# EAGLE design Busboard v12 (EAGLE 8.5.2)
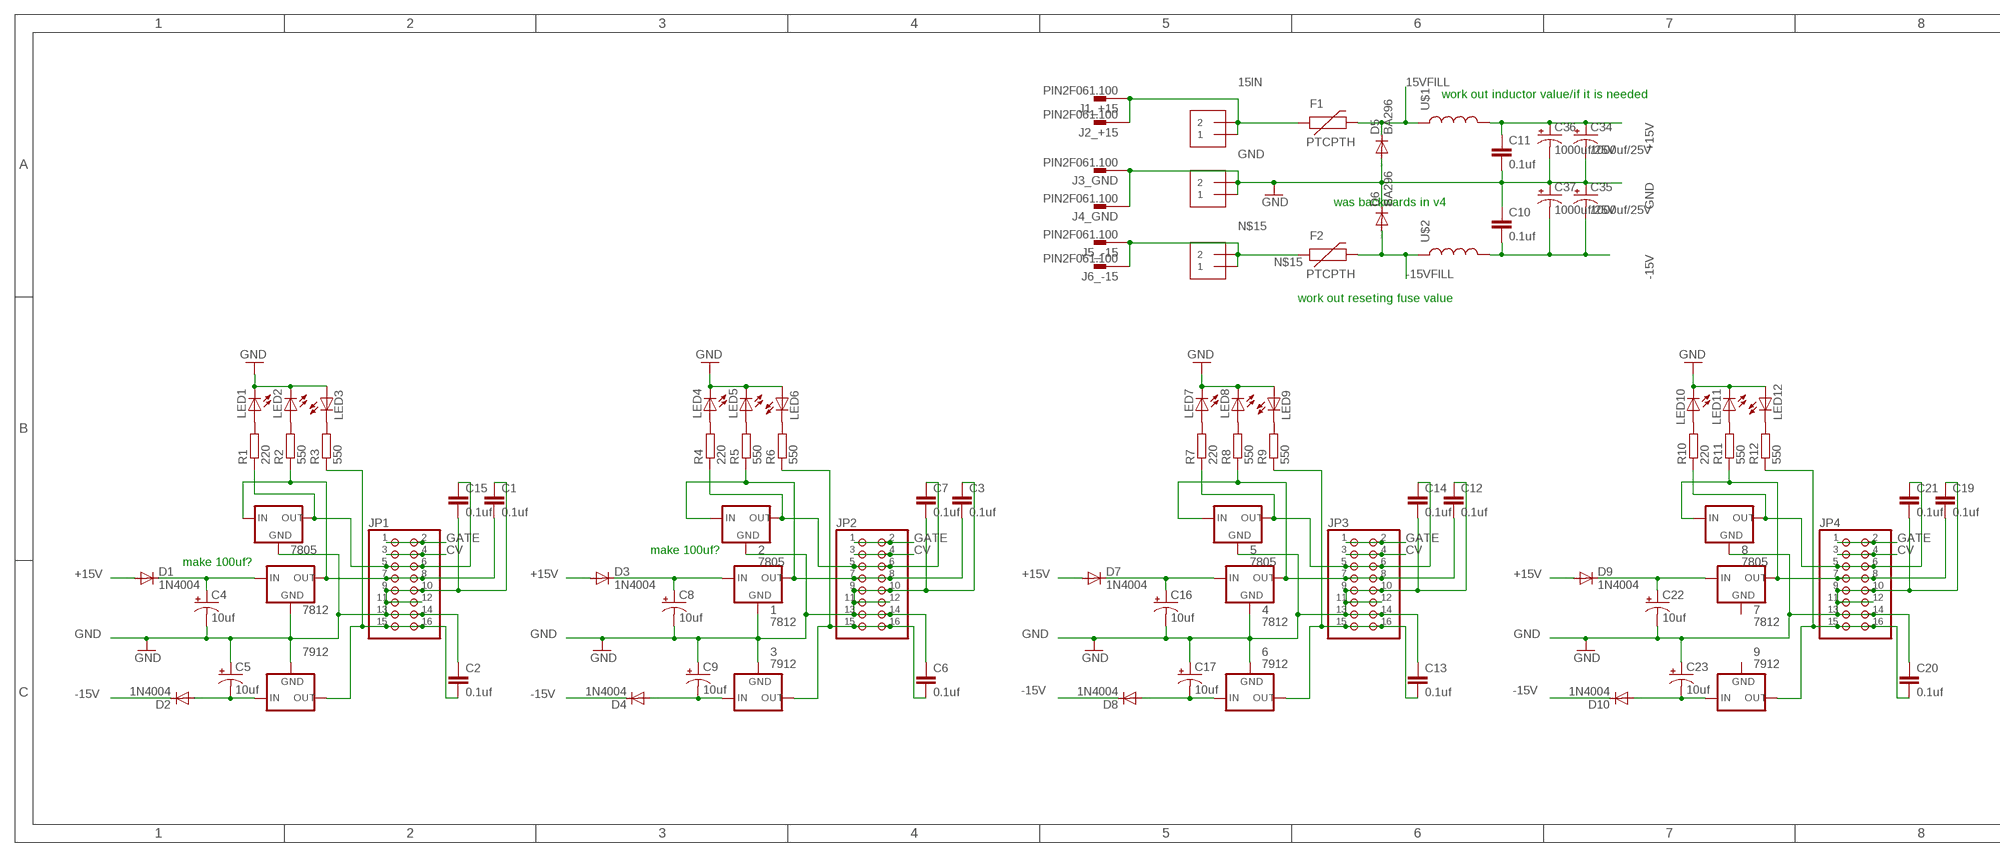
[diagram p0: schematic, sheet 1, part 1 of 2]
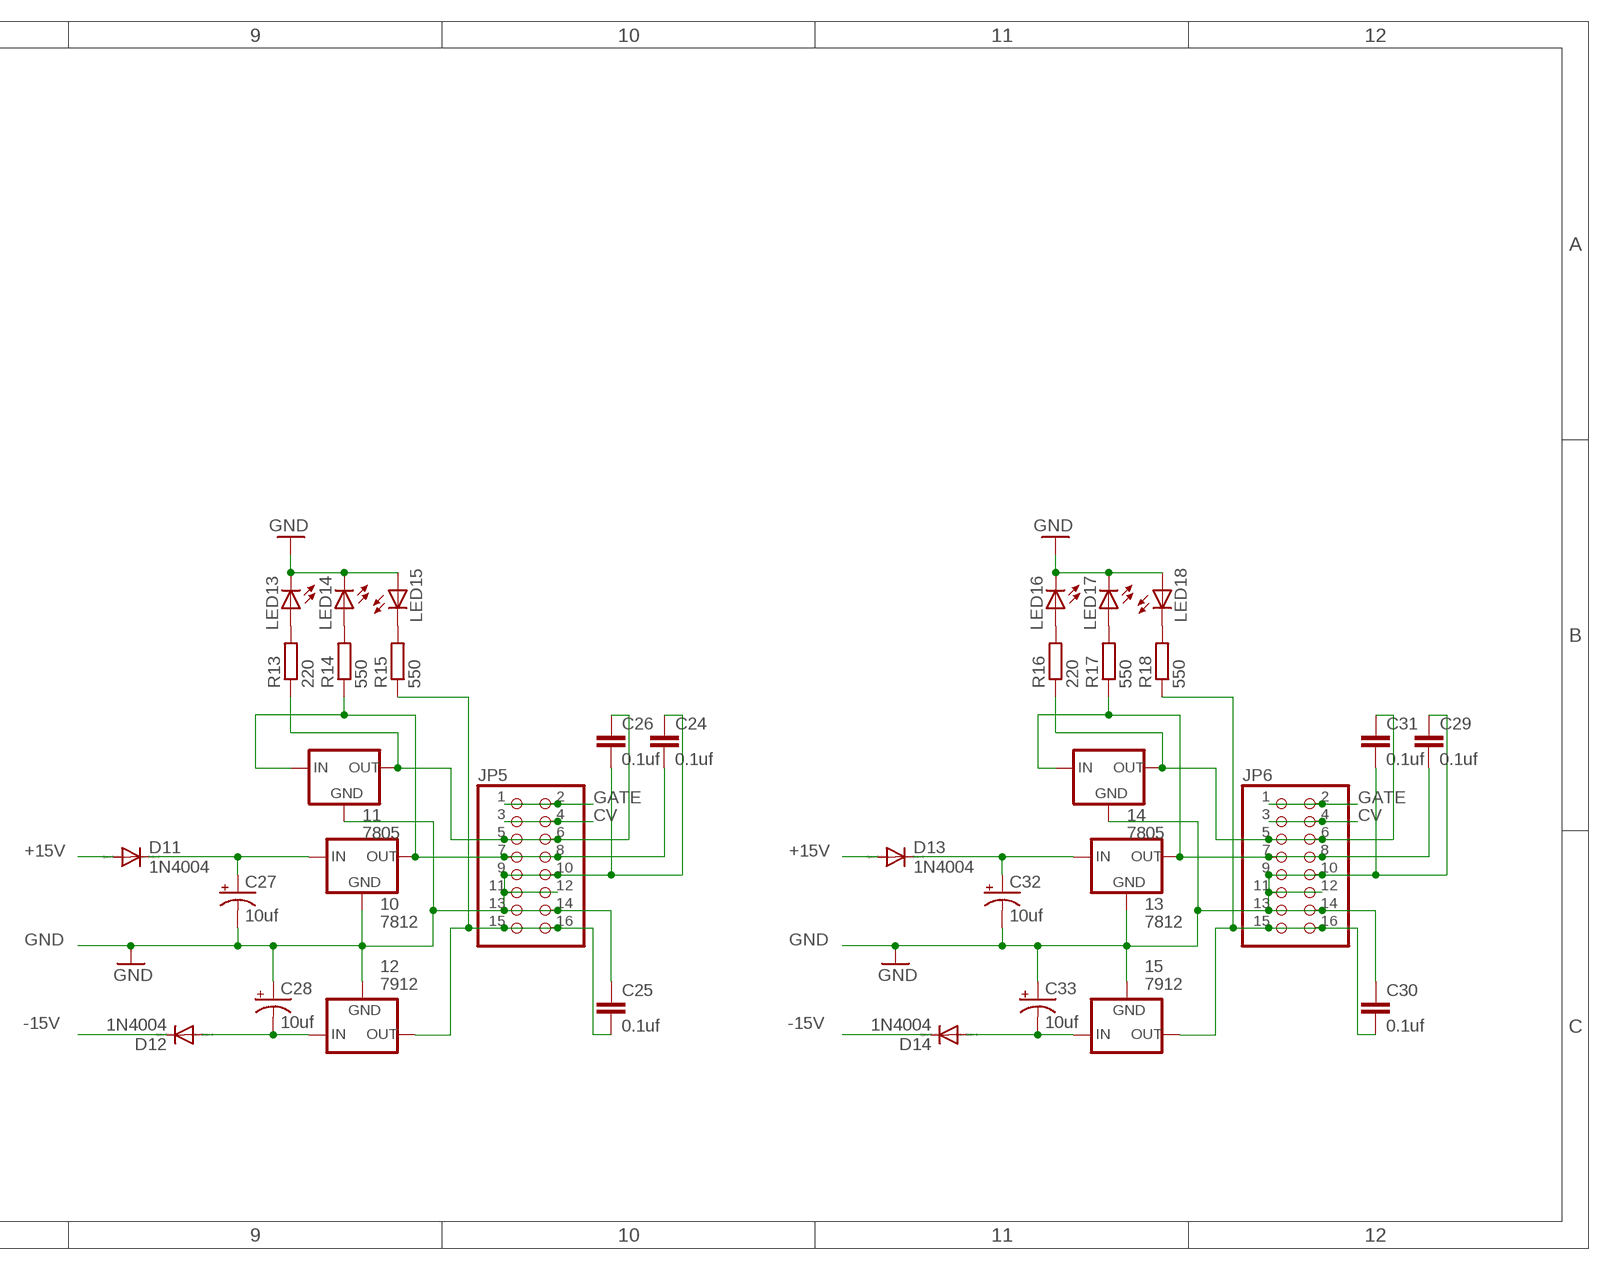
[diagram p1: schematic, sheet 1, part 2 of 2]

## Parts
1  7812  78MXXS  [78MXXS]
2  7805  78MXXS  [78MXXS]
3  7912  79XXS  [79XXS]
4  7812  78MXXS  [78MXXS]
5  7805  78MXXS  [78MXXS]
6  7912  79XXS  [79XXS]
7  7812  78MXXS  [78MXXS]
8  7805  78MXXS  [78MXXS]
9  7912  79XXS  [79XXS]
10  7812  78MXXS  [78MXXS]
11  7805  78MXXS  [78MXXS]
12  7912  79XXS  [79XXS]
13  7812  78MXXS  [78MXXS]
14  7805  78MXXS  [78MXXS]
15  7912  79XXS  [79XXS]
7805  78MXXS  [78MXXS]
7812  78MXXS  [78MXXS]
7912  79XXS  [79XXS]
+15V  1X2-3.5MM  [1X2-3.5MM]
-15V  1X2-3.5MM  [1X2-3.5MM]
C1  0.1uf  0.1UF-50V-20%(PTH)KIT-EZ  [CAP-PTH-SMALL-KIT]
C2  0.1uf  0.1UF-50V-20%(PTH)KIT-EZ  [CAP-PTH-SMALL-KIT]
C3  0.1uf  0.1UF-50V-20%(PTH)KIT-EZ  [CAP-PTH-SMALL-KIT]
C4  10uf  10UF-25V-20%(PTH)  [CPOL-RADIAL-10UF-25V]
C5  10uf  10UF-25V-20%(PTH)  [CPOL-RADIAL-10UF-25V]
C6  0.1uf  0.1UF-50V-20%(PTH)KIT-EZ  [CAP-PTH-SMALL-KIT]
C7  0.1uf  0.1UF-50V-20%(PTH)KIT-EZ  [CAP-PTH-SMALL-KIT]
C8  10uf  10UF-25V-20%(PTH)  [CPOL-RADIAL-10UF-25V]
C9  10uf  10UF-25V-20%(PTH)  [CPOL-RADIAL-10UF-25V]
C10  0.1uf  0.1UF-50V-20%(PTH)KIT-EZ  [CAP-PTH-SMALL-KIT]
C11  0.1uf  0.1UF-50V-20%(PTH)KIT-EZ  [CAP-PTH-SMALL-KIT]
C12  0.1uf  0.1UF-50V-20%(PTH)KIT-EZ  [CAP-PTH-SMALL-KIT]
C13  0.1uf  0.1UF-50V-20%(PTH)KIT-EZ  [CAP-PTH-SMALL-KIT]
C14  0.1uf  0.1UF-50V-20%(PTH)KIT-EZ  [CAP-PTH-SMALL-KIT]
C15  0.1uf  0.1UF-50V-20%(PTH)KIT-EZ  [CAP-PTH-SMALL-KIT]
C16  10uf  10UF-25V-20%(PTH)  [CPOL-RADIAL-10UF-25V]
C17  10uf  10UF-25V-20%(PTH)  [CPOL-RADIAL-10UF-25V]
C19  0.1uf  0.1UF-50V-20%(PTH)KIT-EZ  [CAP-PTH-SMALL-KIT]
C20  0.1uf  0.1UF-50V-20%(PTH)KIT-EZ  [CAP-PTH-SMALL-KIT]
C21  0.1uf  0.1UF-50V-20%(PTH)KIT-EZ  [CAP-PTH-SMALL-KIT]
C22  10uf  10UF-25V-20%(PTH)  [CPOL-RADIAL-10UF-25V]
C23  10uf  10UF-25V-20%(PTH)  [CPOL-RADIAL-10UF-25V]
C24  0.1uf  0.1UF-50V-20%(PTH)KIT-EZ  [CAP-PTH-SMALL-KIT]
C25  0.1uf  0.1UF-50V-20%(PTH)KIT-EZ  [CAP-PTH-SMALL-KIT]
C26  0.1uf  0.1UF-50V-20%(PTH)KIT-EZ  [CAP-PTH-SMALL-KIT]
C27  10uf  10UF-25V-20%(PTH)  [CPOL-RADIAL-10UF-25V]
C28  10uf  10UF-25V-20%(PTH)  [CPOL-RADIAL-10UF-25V]
C29  0.1uf  0.1UF-50V-20%(PTH)KIT-EZ  [CAP-PTH-SMALL-KIT]
C30  0.1uf  0.1UF-50V-20%(PTH)KIT-EZ  [CAP-PTH-SMALL-KIT]
C31  0.1uf  0.1UF-50V-20%(PTH)KIT-EZ  [CAP-PTH-SMALL-KIT]
C32  10uf  10UF-25V-20%(PTH)  [CPOL-RADIAL-10UF-25V]
C33  10uf  10UF-25V-20%(PTH)  [CPOL-RADIAL-10UF-25V]
C34  1000uf/25V  1000UF-25V(PTH)KIT  [CPOL-RADIAL-1000UF-25V-KIT]
C35  1000uf/25V  1000UF-25V(PTH)KIT  [CPOL-RADIAL-1000UF-25V-KIT]
C36  1000uf/25V  1000UF-25V(PTH)KIT  [CPOL-RADIAL-1000UF-25V-KIT]
C37  1000uf/25V  1000UF-25V(PTH)KIT  [CPOL-RADIAL-1000UF-25V-KIT]
D1  1N4004  [DO41-10]
D2  1N4004  [DO41-10]
D3  1N4004  [DO41-10]
D4  1N4004  [DO41-10]
D5  BA296  [P2-15]
D6  BA296  [P2-15]
D7  1N4004  [DO41-10]
D8  1N4004  [DO41-10]
D9  1N4004  [DO41-10]
D10  1N4004  [DO41-10]
D11  1N4004  [DO41-10]
D12  1N4004  [DO41-10]
D13  1N4004  [DO41-10]
D14  1N4004  [DO41-10]
F1  PTCPTH  [PTC]
F2  PTCPTH  [PTC]
GND  1X2-3.5MM  [1X2-3.5MM]
J1_+15  PIN2F061.100  [F061.100]
J2_+15  PIN2F061.100  [F061.100]
J3_GND  PIN2F061.100  [F061.100]
J4_GND  PIN2F061.100  [F061.100]
J5_-15  PIN2F061.100  [F061.100]
J6_-15  PIN2F061.100  [F061.100]
JP1  PINHD-2X8  [2X08]
JP2  PINHD-2X8  [2X08]
JP3  PINHD-2X8  [2X08]
JP4  PINHD-2X8  [2X08]
JP5  PINHD-2X8  [2X08]
JP6  PINHD-2X8  [2X08]
LED1  LED3MM  [LED3MM]
LED2  LED3MM  [LED3MM]
LED3  LED3MM  [LED3MM]
LED4  LED3MM  [LED3MM]
LED5  LED3MM  [LED3MM]
LED6  LED3MM  [LED3MM]
LED7  LED3MM  [LED3MM]
LED8  LED3MM  [LED3MM]
LED9  LED3MM  [LED3MM]
LED10  LED3MM  [LED3MM]
LED11  LED3MM  [LED3MM]
LED12  LED3MM  [LED3MM]
LED13  LED3MM  [LED3MM]
LED14  LED3MM  [LED3MM]
LED15  LED3MM  [LED3MM]
LED16  LED3MM  [LED3MM]
LED17  LED3MM  [LED3MM]
LED18  LED3MM  [LED3MM]
R1  220  R-EU_0207/5V  [0207/5V]
R2  550  R-EU_0207/5V  [0207/5V]
R3  550  R-EU_0207/5V  [0207/5V]
R4  220  R-EU_0207/5V  [0207/5V]
R5  550  R-EU_0207/5V  [0207/5V]
R6  550  R-EU_0207/5V  [0207/5V]
R7  220  R-EU_0207/5V  [0207/5V]
R8  550  R-EU_0207/5V  [0207/5V]
R9  550  R-EU_0207/5V  [0207/5V]
R10  220  R-EU_0207/5V  [0207/5V]
R11  550  R-EU_0207/5V  [0207/5V]
R12  550  R-EU_0207/5V  [0207/5V]
R13  220  R-EU_0207/5V  [0207/5V]
R14  550  R-EU_0207/5V  [0207/5V]
R15  550  R-EU_0207/5V  [0207/5V]
R16  220  R-EU_0207/5V  [0207/5V]
R17  550  R-EU_0207/5V  [0207/5V]
R18  550  R-EU_0207/5V  [0207/5V]
U$1  INDUCTORRLB0912  [RLB0912]
U$2  INDUCTORRLB0912  [RLB0912]

## Nets
15IN: +15V.1 +15V.2 F1.P$1 J1_+15.A1 J1_+15.A2 J2_+15.A1 J2_+15.A2
15VFILL: D5.C F1.P$2 U$1.1
+15V: C11.1 C34.+ C36.+ D1.A D3.A D7.A D9.A D11.A D13.A U$1.2
-15V: C10.2 C35.- C37.- D2.C D4.C D8.C D10.C D12.C D14.C U$2.2
-15VFILL: D6.A F2.P$2 U$2.1
CV: JP1.3 JP1.4 JP2.3 JP2.4 JP3.3 JP3.4 JP4.3 JP4.4 JP5.3 JP5.4 JP6.3 JP6.4
GATE: JP1.1 JP1.2 JP2.1 JP2.2 JP3.1 JP3.2 JP4.1 JP4.2 JP5.1 JP5.2 JP6.1 JP6.2
GND: 1.GND 2.GND 3.GND 4.GND 5.GND 6.GND 8.GND 10.GND 11.GND 12.GND 13.GND 14.GND 15.GND 7805.GND 7812.GND 7912.GND C1.1 C2.1 C3.1 C4.2(-) C5.1(+) C6.1 C7.2 C8.2(-) C9.1(+) C10.1 C11.2 C12.1 C13.1 C14.2 C15.2 C16.2(-) C17.1(+) C19.1 C20.1 C21.2 C22.2(-) C23.1(+) C24.1 C25.1 C26.2 C27.2(-) C28.1(+) C29.1 C30.1 C31.2 C32.2(-) C33.1(+) C34.- C35.+ C36.- C37.+ D5.A D6.C GND.1 GND.2 J3_GND.A1 J3_GND.A2 J4_GND.A1 J4_GND.A2 JP1.9 JP1.10 JP1.11 JP1.12 JP1.13 JP1.14 JP2.9 JP2.10 JP2.11 JP2.12 JP2.13 JP2.14 JP3.9 JP3.10 JP3.11 JP3.12 JP3.13 JP3.14 JP4.9 JP4.10 JP4.11 JP4.12 JP4.13 JP4.14 JP5.9 JP5.10 JP5.11 JP5.12 JP5.13 JP5.14 JP6.9 JP6.10 JP6.11 JP6.12 JP6.13 JP6.14 LED1.K(C) LED2.K(C) LED3.A LED4.K(C) LED5.K(C) LED6.A LED7.K(C) LED8.K(C) LED9.A LED10.K(C) LED11.K(C) LED12.A LED13.K(C) LED14.K(C) LED15.A LED16.K(C) LED17.K(C) LED18.A
N$1: 7912.IN C5.2(-) D2.A
N$2: 7912.OUT C2.2 JP1.15 JP1.16 R3.1
N$3: 6.OUT C13.2 JP3.15 JP3.16 R9.1
N$4: 7812.IN C4.1(+) D1.C
N$5: 7805.IN 7812.OUT C1.2 JP1.7 JP1.8 R2.1
N$6: 3.OUT C6.2 JP2.15 JP2.16 R6.1
N$7: 6.IN C17.2(-) D8.A
N$8: 3.IN C9.2(-) D4.A
N$9: 1.IN C8.1(+) D3.C
N$12: LED1.A R1.2
N$14: LED2.A R2.2
N$15: -15V.1 -15V.2 F2.P$1 J5_-15.A1 J5_-15.A2 J6_-15.A1 J6_-15.A2
N$17: LED3.K(C) R3.2
N$18: 1.OUT 2.IN C3.2 JP2.7 JP2.8 R5.1
N$19: 4.IN C16.1(+) D7.C
N$20: 2.OUT C7.1 JP2.5 JP2.6 R4.1
N$21: 7805.OUT C15.1 JP1.5 JP1.6 R1.1
N$23: LED4.A R4.2
N$24: LED5.A R5.2
N$25: LED6.K(C) R6.2
N$26: 4.OUT 5.IN C12.2 JP3.7 JP3.8 R8.1
N$27: 5.OUT C14.1 JP3.5 JP3.6 R7.1
N$28: LED7.A R7.2
N$29: LED8.A R8.2
N$30: LED9.K(C) R9.2
N$47: 9.OUT C20.2 JP4.15 JP4.16 R12.1
N$48: 9.IN C23.2(-) D10.A
N$49: 7.IN C22.1(+) D9.C
N$50: 7.OUT 8.IN C19.2 JP4.7 JP4.8 R11.1
N$51: 8.OUT C21.1 JP4.5 JP4.6 R10.1
N$52: LED10.A R10.2
N$53: LED11.A R11.2
N$54: LED12.K(C) R12.2
N$55: 15.OUT C30.2 JP6.15 JP6.16 R18.1
N$56: 12.OUT C25.2 JP5.15 JP5.16 R15.1
N$57: 12.IN C28.2(-) D12.A
N$58: 10.IN C27.1(+) D11.C
N$59: 10.OUT 11.IN C24.2 JP5.7 JP5.8 R14.1
N$60: 11.OUT C26.1 JP5.5 JP5.6 R13.1
N$61: LED13.A R13.2
N$62: LED14.A R14.2
N$63: LED15.K(C) R15.2
N$64: 15.IN C33.2(-) D14.A
N$65: 13.IN C32.1(+) D13.C
N$66: 13.OUT 14.IN C29.2 JP6.7 JP6.8 R17.1
N$67: 14.OUT C31.1 JP6.5 JP6.6 R16.1
N$68: LED16.A R16.2
N$69: LED17.A R17.2
N$70: LED18.K(C) R18.2
Unconnected: 7.GND 9.GND

## Notes on the sheet
- work out inductor value/if it is needed
- was backwards in v4
- work out reseting fuse value
- make 100uf?
- make 100uf?

## Library data of the parts
1 2 4 5 7 8 10 11 13 14 7805 7812 = v-reg:78MXXS: VOLTAGE REGULATOR
3 6 9 12 15 7912 = v-reg:79XXS: VOLTAGE REGULATOR
+15V -15V GND = adafruit:1X2: 3.5mm Terminal block http://www.ladyada.net/library/pcb/eaglelibrary.html
C1-C3 C6 C7 C10-C15 C19-C21 C24-C26 C29-C31 = SparkFun-Capacitors:0.1UF-50V-20%(PTH): CAP-08370; PROD_ID: CAP-08370
C4 C5 C8 C9 C16 C17 C22 C23 C27 C28 C32 C33 = SparkFun-Capacitors:10UF-25V-20%(PTH): CAP-08440; PROD_ID: CAP-08440
C34-C37 = SparkFun-Capacitors:1000UF-25V(PTH): CAP-08070; PROD_ID: CAP-09538
D1-D4 D7-D14 = diode:1N4004: DIODE general purpose rectifier, 1 A
D5 D6 = diode:BA296: DIODE
F1 F2 = SparkFun-PowerIC:PTC: Resettable Fuse PTC Resettable Fuse. Spark Fun Electronics SKU : COM-08357
J1_+15 J2_+15 J3_GND J4_GND J5_-15 J6_-15 = con-faston:PIN2: Flachstecker Typ Tyco/Electronics/AMP TAB, FASTON Printed Circuit Board Tabs Source: http://www.buerklin.com, http://catalog.tycoelectronics.com; OC_FARNELL: unknown; OC_NEWARK: unknown
JP1-JP6 = pinhead:PINHD-2X8: PIN HEADER
LED1-LED18 = led:LED: LED OSRAM: - CHIPLED LG R971, LG N971, LY N971, LG Q971, LY Q971, LO R971, LY R971 LH N974, LH R974 LS Q976, LO Q976, LY Q976 LO Q996 - Hyper CHIPLED LW Q18S LB Q993, LB Q99A, LB R99A - SideLED LS A670, LO A670, LY A670, LG A670, LP A670 LB A673, LV A673, LT A673, LW A673 LH A674 LY A675 LS A676, LA A676, LO A676, LY A676, LW A676 LS A679, LY A679, LG A679 - Hyper Micro SIDELED® LS Y876, LA Y876, LO Y876, LY Y876 LT Y87S - SmartLED LW L88C, LW L88S LB L89C, LB L89S, LG L890 LS L89K, LO L89K, LY L89K LS L896, LA L896, LO L896, LY L896 - TOPLED LS T670, LO T670, LY T670, LG T670, LP T670 LSG T670, LSP T670, LSY T670, LOP T670, LYG T670 LG T671, LOG T671, LSG T671 LB T673, LV T673, LT T673, LW T673 LH T674 LS T676, LA T676, LO T676, LY T676, LB T676, LH T676, LSB T676, LW T676 LB T67C, LV T67C, LT T67C, LS T67K, LO T67K, LY T67K, LW E67C LS E67B, LA E67B, LO E67B, LY E67B, LB E67C, LV E67C, LT E67C LW T67C LS T679, LY T679, LG T679 LS T770, LO T770, LY T770, LG T770, LP T770 LB T773, LV T773, LT T773, LW T773 LH T774 LS E675, LA E675, LY E675, LS T675 LS T776, LA T776, LO T776, LY T776, LB T776 LHGB T686 LT T68C, LB T68C - Hyper Mini TOPLED® LB M676 - Mini TOPLED Santana® LG M470 LS M47K, LO M47K, LY M47K Source: http://www.osram.convergy.de LUXEON: - LUMILED® LXK2-PW12-R00, LXK2-PW12-S00, LXK2-PW14-U00, LXK2-PW14-V00 LXK2-PM12-R00, LXK2-PM12-S00, LXK2-PM14-U00 LXK2-PE12-Q00, LXK2-PE12-R00, LXK2-PE12-S00, LXK2-PE14-T00, LXK2-PE14-U00 LXK2-PB12-K00, LXK2-PB12-L00, LXK2-PB12-M00, LXK2-PB14-N00, LXK2-PB14-P00, LXK2-PB14-Q00 LXK2-PR12-L00, LXK2-PR12-M00, LXK2-PR14-Q00, LXK2-PR14-R00 LXK2-PD12-Q00, LXK2-PD12-R00, LXK2-PD12-S00 LXK2-PH12-R00, LXK2-PH12-S00 LXK2-PL12-P00, LXK2-PL12-Q00, LXK2-PL12-R00 Source: www.luxeon.com KINGBRIGHT: KA-3528ASYC Source: www.kingbright.com
R1-R18 = resistor:R-EU_: RESISTOR, European symbol
U$1 U$2 = SparkFun-Passives:INDUCTOR: Inductors Basic Inductor/Choke - 0603 and 1206. Footprints are not proven and vary greatly between part numbers. SRN6045- 33uH, 20% 1.4A SDR0403-560KL - 56uH, 10%, 500mA RMS/740mA peak

## Board
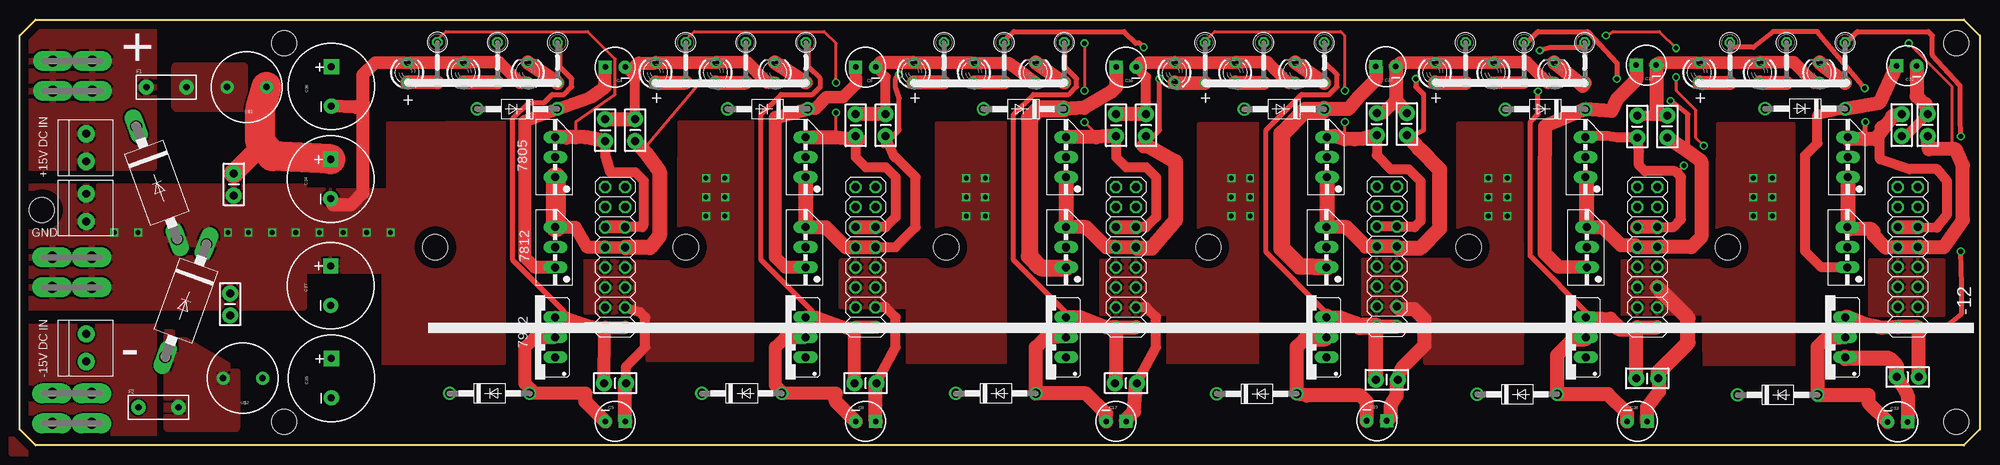
[diagram p2: board, top side]
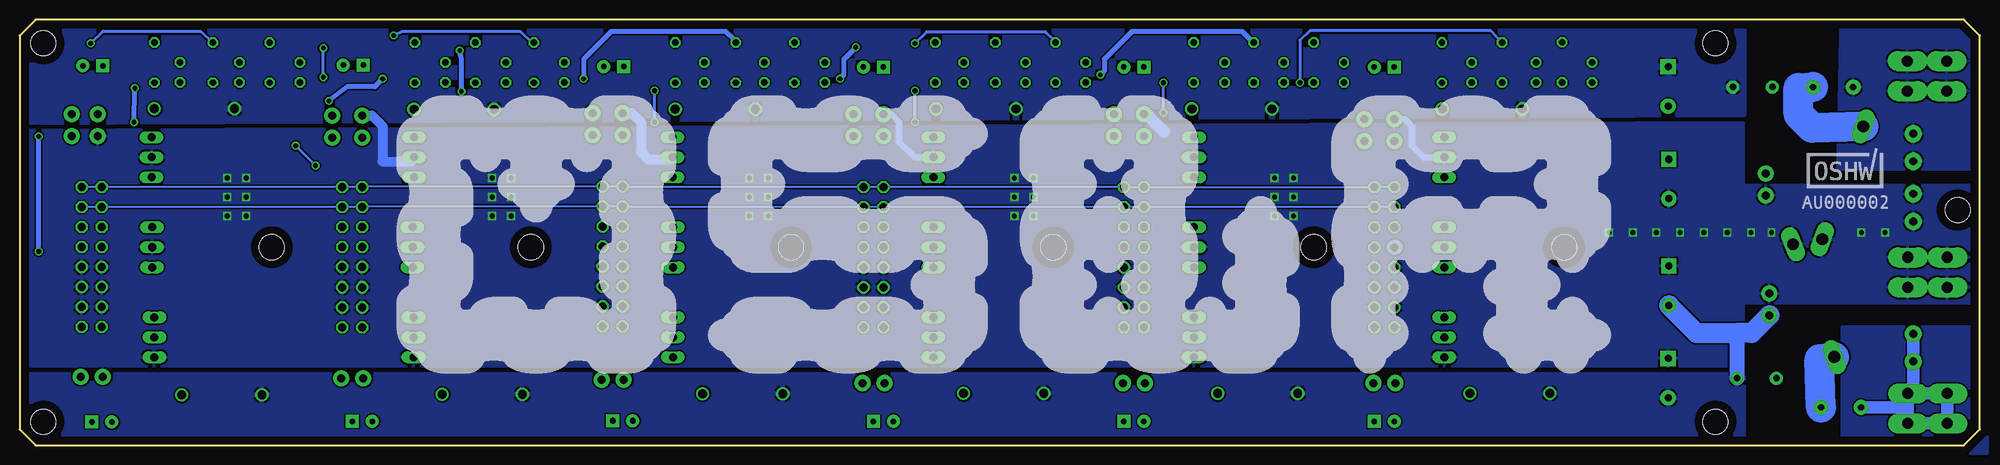
[diagram p3: board, bottom side, seen from below]

Size 248.5 x 54 mm. Coordinates in mm from the lower left corner, seen from the top.
Outline: 0,52 2,54 246.5,54 248.5,52 248.5,2 246.5,0 2,0 0,2 0,52
Copper layers (1*16): Top 0.035mm / dielectric 1.5mm / Bottom 0.035mm
Design rules "default": minimum track width 10mil, minimum drill 24mil, track to track 8mil, track to pad 8mil, pad to pad 8mil, via to via 8mil, smd to smd 8mil, copper to edge 40mil, drill to drill 8mil, minimum pad ring 10mil, minimum via ring 8mil, stop-mask expansion 4mil, vias tented up to drill 0mil, thermal gap 10mil
Holes 3.2 mm at 117.47,25.13 150.72,25.13 33.5,3 33.5,51 245.5,51 245.5,3 183.7,25.13 84.45,25.13 216.53,25.13 52.69,25.13 2.81,29.84

### Footprints (pad centres in the part's own frame; a part is rotated, then mirrored left to right if it is on the bottom)
78MXXS = drill 1.016 long: GND 0,-2.54; IN -2.54,-2.54; OUT 2.54,-2.54
79XXS = drill 1.016 long: GND -2.54,-2.54; IN 0,-2.54; OUT 2.54,-2.54
1X2-3.5MM = drill 1 pad 2.184: 1 1.8,0; 2 -1.7,0
CAP-PTH-SMALL-KIT = drill 1.016 pad 2.032: 1 -1.397,0; 2 1.397,0
CPOL-RADIAL-10UF-25V = drill 0.7 pad 1.651 square: 1 1.27,0 | drill 0.7 pad 1.651: 2 -1.27,0
CPOL-RADIAL-1000UF-25V-KIT = drill 0.9 pad 1.93 square: + 2.5,0 | drill 0.9 pad 1.93: - -2.5,0
DO41-10 = drill 1.118: A 5.08,0; C -5.08,0
P2-15 = drill 1.499 long: A 7.62,0; C -7.62,0
PTC = drill 0.8 pad 1.88: P$1 -2.54,0; P$2 2.54,0
F061.100 = drill 1.4 pad 2.54 long: A1 -2.5,0; A2 2.5,0
2X08 = drill 1.016 octagon: 1 -8.89,-1.27; 2 -8.89,1.27; 3 -6.35,-1.27; 4 -6.35,1.27; 5 -3.81,-1.27; 6 -3.81,1.27; 7 -1.27,-1.27; 8 -1.27,1.27; 9 1.27,-1.27; 10 1.27,1.27; 11 3.81,-1.27; 12 3.81,1.27; 13 6.35,-1.27; 14 6.35,1.27; 15 8.89,-1.27; 16 8.89,1.27
LED3MM = drill 0.813 octagon: A -1.27,0; K 1.27,0
0207/5V = drill 0.813 octagon: 1 -2.54,0; 2 2.54,0
RLB0912 = drill 0.813 pad 1.651: 1 2.502,0; 2 -2.502,0

### Placement (x,y rotation side)
1  97.09,25.13 90 top
2  97.09,36.56 90 top
3  97.09,13.7 90 top
4  130.11,25.13 90 top
5  130.11,36.56 90 top
6  130.11,13.7 90 top
7  163.15,25.13 90 top
8  163.2,36.56 90 top
9  163.15,13.7 90 top
10  196.17,25.13 90 top
11  195.97,36.56 90 top
12  196.02,13.7 90 top
13  229.19,25.13 90 top
14  229.24,36.56 90 top
15  228.88,13.7 90 top
7805  65.34,36.56 90 top
7812  65.34,25.13 90 top
7912  65.34,13.7 90 top
+15V  8.43,37.83 270 top
-15V  8.43,12.43 270 top
C1  78.04,39.97 270 top
C2  75.5,7.89 180 top
C3  109.79,40.6 270 top
C4  75.5,47.99 180 top
C5  75.5,3.04 0 top
C6  107.25,7.89 180 top
C7  105.98,40.6 90 top
C8  107.25,47.99 180 top
C9  107.25,3.04 0 top
C10  26.68,17.9 270 top
C11  27.15,33.09 270 top
C12  142.81,40.6 270 top
C13  140.27,7.89 180 top
C14  139,40.6 90 top
C15  74.23,39.97 90 top
C16  140.27,47.99 180 top
C17  139,3.04 0 top
C19  175.85,40.77 270 top
C20  173.31,8.31 180 top
C21  172.04,40.78 90 top
C22  173.19,48.06 180 top
C23  172.05,3.11 0 top
C24  208.87,40.45 270 top
C25  206.33,8.49 180 top
C26  205.06,40.45 90 top
C27  206.21,48.23 180 top
C28  205.07,3.03 0 top
C29  241.89,40.62 270 top
C30  239.35,8.67 0 top
C31  238.59,40.62 270 top
C32  239.23,48.16 180 top
C33  238.09,2.95 0 top
C34  39.41,33.79 90 top
C35  39.51,8.51 90 top
C36  39.51,45.53 90 top
C37  39.41,20.26 90 top
D1  63.07,42.68 180 top
D2  59.57,6.58 0 top
D3  94.82,42.68 180 top
D4  91.55,6.58 0 top
D5  17.37,33.3 290 top
D6  21.07,18.36 250 top
D7  127.26,42.68 180 top
D8  123.76,6.58 0 top
D9  160.31,42.65 180 top
D10  156.84,6.55 0 top
D11  193.43,42.62 180 top
D12  189.86,6.47 0 top
D13  226.35,42.7 180 top
D14  222.88,6.39 0 top
F1  18.59,45.45 0 top
F2  17.59,4.81 0 top
GND  8.43,30.21 270 top
J1_+15  6.69,48.76 180 top
J2_+15  6.69,44.95 180 top
J3_GND  6.62,23.86 180 top
J4_GND  6.62,20.05 180 top
J5_-15  6.62,6.58 180 top
J6_-15  6.62,2.77 180 top
JP1  75.5,23.86 270 top
JP2  107.25,23.86 270 top
JP3  140.27,23.86 270 top
JP4  173.31,23.94 270 top
JP5  206.33,23.87 270 top
JP6  239.39,23.88 270 top
LED1  49.14,47.3 90 top
LED2  56.26,47.3 90 top
LED3  64.42,47.3 90 top
LED4  80.62,47.3 90 top
LED5  88.24,47.3 90 top
LED6  95.74,47.3 90 top
LED7  113.37,47.3 90 top
LED8  120.99,47.3 90 top
LED9  128.79,47.3 90 top
LED10  146.42,47.3 90 top
LED11  154.12,47.3 90 top
LED12  161.7,47.3 90 top
LED13  179.44,47.3 90 top
LED14  186.85,47.3 90 top
LED15  194.54,47.3 90 top
LED16  212.96,47.3 90 top
LED17  220.62,47.3 90 top
LED18  228.18,47.3 90 top
R1  52.95,48.6 270 top
R2  60.57,48.57 270 top
R3  68.19,48.55 270 top
R4  84.43,48.57 270 top
R5  92.05,48.57 270 top
R6  99.67,48.57 270 top
R7  117.18,48.57 270 top
R8  124.8,48.57 270 top
R9  132.42,48.57 270 top
R10  150.27,48.55 270 top
R11  157.7,48.55 270 top
R12  165.38,48.55 270 top
R13  183.29,48.55 270 top
R14  190.72,48.55 270 top
R15  198.4,48.55 270 top
R16  216.81,48.55 270 top
R17  223.99,48.55 270 top
R18  231.42,48.55 270 top
U$1  28.79,45.45 180 top
U$2  28.28,8.51 180 top

### Tracks (layer width: path | path; a pad name or v marks a point on that pad's centre or on a via)
15IN
  pour Bottom: -1,35 17.99,34.89 17.54,54.7 -1,55
  pour Top: -1,35.25 17,35.25 17,55 -1,55
15VFILL
  Bottom 3.81: D5.C 21.26,40.26 23,42 23,45.32 F1.P$2
  pour Top (no thermals): 19.86,47.99 28.29,47.99 28.29,42.91 19.86,42.91
+15V
  Top 2.54: C11.1 30.5,37.84 30.5,38.5
  Top 3.81: C34.+ 32.01,36.69 30.5,38.5 30.5,42.66 U$1.2
  pour Bottom: 30,42.01 250,41 250,54.5 30,54.5
-15IN
  pour Top: -1,15 17,15 17,-1 -1,-1
  pour Bottom: -1,15 17.5,15 17.5,-1 -1,-1
-15V
  Bottom 1.93: 30.79,14.26 U$2.2
  Bottom 2.54: C10.2 28.93,14.26 30.79,14.26 35.91,14.26 C37.-
  pour Bottom: 250,-1 250,9 30,9 30,-1
-15VFILL
  Bottom 3.81: F2.P$2 20.33,10.93 D6.A
  pour Top: 18.86,2.27 18.86,14.35 27.29,9.35 27.29,2.27
CV
  Bottom 0.254: JP1.3 JP1.4 JP2.3 JP2.4 JP3.3 JP3.4 171.96,30.21 JP4.3 JP4.4 204.98,30.3 JP5.3 JP5.4 238.11,30.22 JP6.3 JP6.4
GATE
  Bottom 0.254: JP1.1 JP1.2 JP2.1 JP2.2 JP3.1 JP3.2 171.96,32.75 JP4.1 JP4.2 204.98,32.84 JP5.1 JP5.2 238.11,32.76 JP6.1 JP6.2
GND  (via drill 0.6)
  Top 1.27: C13.1 141.67,8.02 144.08,12.43 144.08,16.24 142.81,17.51 JP3.14 | C6.1 108.65,8.02 111.06,12.43 111.06,16.24 109.79,17.51 JP2.14 | C2.1 76.9,10.02 79.31,12.43 79.31,16.24 78.67,16.88 JP1.14 | C12.1 142.81,46.72 C16.2 | C3.1 109.79,46.72 C8.2 | C1.1 78.04,46.72 C4.2 | C26.2 C24.1 | C31.2 239.1,39.23 C29.1
  Top 1.6: 43.5,47 45.07,48.57 LED1.K LED2.K 56.29,48.6 60.8,48.6 63.37,46.03 LED3.A | LED6.A 94.77,46.03 92.2,48.6 88.27,48.6 LED5.K LED4.K | LED7.K LED8.K 125.4,48.5 LED9.A | LED12.A 160.77,46.03 158.2,48.6 154.15,48.6 LED11.K LED10.K | LED15.A 193.67,46.03 191.1,48.6 186.88,48.6 LED14.K LED13.K 174.98,48.57 C22.2 | LED18.A 227.47,46.03 224.9,48.6 220.65,48.6 LED17.K LED16.K 207.82,48.57 C27.2
  Top 1.676: 43.5,47 43.5,43.5 | 43.5,43.5 43.6,43.5 42.58,42.9 C36.- | 78.04,46.72 78.04,48.04 78.5,48.5 80.55,48.5 LED4.K | LED7.K 109.1,48.57 C8.2 | LED10.K 142.04,48.49 C16.2 | C21.2 172.83,42.17 174.46,43.81 | 43.5,43.5 43.5,32 42,30.5 39.7,30.5 C34.-
  Top 1.778: C2.1 76.77,7.76 C5.1 | C6.1 108.52,7.76 C9.1 | C12.1 C14.2 | C3.1 C7.2 | C15.2 C1.1 | C13.1 141.54,7.76 141.54,7.58 141.27,4.31 140.27,3.31 C17.1 | JP4.14 174.92,17.26 176.85,17.26 178.12,15.99 178.12,12.68 175.25,9.81 C20.1 174.58,7.94 174.58,6.32 173.86,5.11 173.86,3.65 C23.1 | C22.2 174.46,43.81 C19.1 | C25.1 207.84,8.38 207.84,6.84 206.34,4.84 C28.1 | C27.2 207.48,42.24 C24.1 | C30.1 238.06,8.56 238.06,8.62 239.36,6.32 C33.1 | C32.2 240.5,44.28 241.62,43.16 241.62,43.3 C29.1
  Top 1.93: C30.1 237.95,10.05 237,11 231.44,11 15.GND | C25.1 207.73,9.23 211.5,13 211.5,16.16 JP5.12
  Bottom 0.813: C14.2 138,42 137,41 137,38.5 135,36.5 132.71,36.5 5.GND | C15.2 72.86,41.36 72,40.5 72,38 70.5,36.5 67.94,36.5 7805.GND
  Bottom 1.27: C26.2 203.84,41.84 202.5,40.5 202.5,36 198.86,36 11.GND | C21.2 170.93,42.17 169.75,41 169.75,37.25 168.75,36.25 165.92,36.25 8.GND
  Bottom 1.6: C7.2 arc45 105.33,41.73 103.4,39.8
  other vias: 44,27 47,27 87,31.5 89.4,31.5 87,33.9 89.4,33.9 89.4,29.1 87,29.1 120,33.9 122.4,33.9 120,31.5 120,29.1 122.4,31.5 122.4,29.1 153.6,33.9 156,33.9 153.6,31.5 156,31.5 153.6,29.1 156,29.1 186.2,33.9 186.2,31.5 186.2,29.1 188.6,33.9 188.6,31.5 188.6,29.1 219.8,33.9 219.8,31.5 219.8,29.1 222.2,33.9 222.2,31.5 222.2,29.1 41,27 38,27 35,27 32,27 29,27 26.4,27 15,27 12,27
  pour Bottom: -1,18 36,18 36,33 -1,33
  pour Top: -1,32.75 36,32.75 36,17.51 -1,17.5
  pour Bottom: 30,10 250,10 250,40 30,41
  pour Top: 234.5,16.5 244,16.5 244,23.5 234.5,23.5
  pour Top: 203.1,16.6 213.4,16.7 213.5,10.25 225,10.25 225,40.8 215.2,40.8 215.1,23.5 203.1,23.4
  pour Top: 170.2,16.6 178,16.6 178.1,10.4 190.6,10.4 190.5,40.85 182.3,40.85 182.3,23.6 170.2,23.6
  pour Top: 137,16.6 145.5,16.6 145.5,10.5 157,10.5 157,40.9 149.4,40.8 149.4,23.4 137,23.5
  pour Top: 104,17.5 112.5,17.5 112.5,10.5 125,10.5 125,41 116.2,40.9 116.2,23.4 115,23.5 104,23.5
  pour Top: 71.64,16.74 79.4,16.87 79.5,10.8 93,10.8 93,41 83.5,41 83.4,23.28 71.64,23.47
  pour Top: 34,22 46,21.9 46,10.3 61.5,10.4 61.5,41 46.6,40.9 46.6,32.4 34,32.5
N$1
  Top 1.676: 71.69,6.58 D2.A 64.84,7.08 64.07,7.85 64.07,12.43 65.34,13.7 7912.IN
  Top 1.778: C5.2 71.73,5.54 71.73,5.95 71.69,5.98 71.69,6.58
N$2
  Top 0.61: R3.1 68.5,51 68.5,48 70,46.5 70,45.5 69,44.5 67.5,44.5 66.5,43.5 64.5,43.5 62.5,41.5 62.5,23.5 69,17 69,16.24
  Top 1.676: 7912.OUT 69,16.24 69.06,16.24 72.51,15.05 JP1.15 | JP1.15 JP1.16 | C2.2 74.17,14.47 JP1.15
N$3
  Top 0.61: R9.1 132.5,51 132.5,48 134,46.5 134,45.5 133,44.5 128.5,44.5 126,42 126,23.5 132.5,17 6.OUT
  Top 1.778: JP3.15 JP3.16 | JP3.15 137.73,14.97 134.46,16.24 6.OUT | JP3.15 139,10.02 C13.2
N$4
  Top 1.676: C4.1 74.23,45.45 72.46,44.18 D1.C 64.07,41.1 64.07,23.86 65.34,22.59 7812.IN
N$5  (via drill 0.6)
  Top 0.406: v86.2,46 79.5,38 79.43,37.07
  Top 1.676: 7812.OUT 68,27.67 70.42,27.67 71.88,25.16 | 71.88,25.16 JP1.8 | 71.88,25.16 74.19,25.16 JP1.7
  Top 1.93: C1.2 79.43,37.07 81.1,34.7 81.1,26.6 79.91,25.08 76.86,25.09 JP1.8
  Top 2.54: 68,27.67 68,34 7805.IN
  Bottom 0.406: 61,51.5 R2.1 62,52.6 84.9,52.6 86.2,51.4 v86.2,46
  Bottom 1.676: 74.1,25.16 74.39,25.16 74.4,25.16
  Bottom 1.93: JP1.7 74.1,25.12 74.1,25.16
N$6
  Top 0.61: R6.1 100,51 100,48 101.5,46.5 101.5,45.5 100.5,44.5 96.5,44.5 94,42 94,23.5 100.5,17 3.OUT
  Top 1.676: C6.2 105.85,14.84 | 105.85,14.84 JP2.15 JP2.16 | 105.85,14.84 104.84,14.84 100.94,16.24 3.OUT
N$7
  Top 1.676: 6.IN 130.11,13.7
  Top 1.778: 130.11,13.7 128.84,12.43 D8.A 135.19,6.58 137.73,4.04 C17.2
N$8
  Top 1.676: 103.44,6.58 96.86,6.58 | D4.A 96.86,6.58 | 96.86,6.58 95.82,7.62 95.82,12.43 97.09,13.7 3.IN
  Top 1.778: C9.2 103.44,5.58 103.44,6.58
N$9
  Top 1.6: C8.1 106,45.8 104.4,44.2 102.3,44.2 100.9,42.7 D3.C
  Top 1.676: D3.C 95.82,41.6 95.82,23.86 97.09,22.59 1.IN
N$12
  Top 1.778: R1.2 LED1.A
N$14
  Top 1.778: R2.2 LED2.A
N$15
  Bottom 1.6: -15V.2 -15V.1 8.43,7.27 J5_-15.A1 | J5_-15.A1 J5_-15.A2 J6_-15.A2 J6_-15.A1 9.12,4.7 | 9.12,4.7 J5_-15.A1 | F2.P$1 9.23,4.81 9.12,4.7
N$17
  Top 1.778: R3.2 LED3.K
N$18  (via drill 0.6)
  Top 0.61: v111.5,47 111,46.5 111,45.5 111.5,44 111.5,40 109.5,38 C3.2
  Top 1.27: JP2.8 111.06,25.13 113.6,27.67 113.6,34.02 111.06,36.56 110.93,36.56 C3.2
  Top 1.778: JP2.8 JP2.7 104.71,25.13 102.17,27.67 1.OUT
  Top 1.93: 2.IN 1.OUT
  Bottom 0.61: v111.5,47 111,47.5 111,49 107.5,52.5 93.5,52.5 92.5,51.5 R5.1
N$19
  Top 1.778: C16.1 139,45.45 138.37,44.81 134.97,42.81 D7.C
  Top 2.184: D7.C 129.18,42.68 128,41.5 128,24 129.5,22.5 132.56,22.5 4.IN
N$20  (via drill 0.6)
  Top 0.406: v103.5,46 103.5,51 102,52.5 85.5,52.5 84.5,51.5 R4.1 | v103.5,42.2 103.5,39.5 103.44,39.1
  Top 1.27: C7.1 105.98,36.56 107.25,35.29 109.79,35.29 111.06,34.02 111.06,28.94 109.79,27.67 JP2.6
  Top 1.778: JP2.5 JP2.6 | 2.OUT 103.44,39.1 105.71,38.83 106.35,38.83 C7.1
  Bottom 0.406: v103.5,42.2 v103.5,46
N$21
  Top 0.406: 70.5,39.1 70.5,41 75.5,44.5 75.5,49 72,52.5 54,52.5 53,51.5 R1.1
  Top 1.27: C15.1 74.23,36.79 74.86,34.66 78.04,34.66 79.11,33.59 79.07,28.21 78.94,27.66 JP1.6
  Top 1.676: JP1.6 JP1.5 | 69.28,38.97 7805.OUT
  Top 1.778: C15.1 71.69,39.1 70.5,39.1 7805.OUT
N$23
  Top 1.778: LED4.A R4.2
N$24
  Top 1.778: LED5.A R5.2
N$25
  Top 1.778: LED6.K R6.2
N$26  (via drill 0.6)
  Top 0.61: R8.1 125,51.5 126,52.5 140,52.5 141.5,51 142,51 v142.5,50.5 | v144.5,46.5 144.5,40 142.5,38 C12.2
  Top 1.778: JP3.8 JP3.7 137.73,25.13 135.19,27.67 4.OUT
  Top 1.93: 142.5,38 143,38 146.5,36 146.5,28.5 143.5,25 141.67,25 JP3.8 | 5.IN 4.OUT
  Bottom 0.61: v142.5,50.5 144,49 144,47 v144.5,46.5
N$27  (via drill 0.6)
  Top 0.406: v135,41 136.5,39.5 136.46,39.1 | v135,51 v135,45
  Top 1.27: C14.1 139,36.56 140.27,35.29 142.81,35.29 144.08,34.02 144.08,28.94 142.81,27.67 JP3.6
  Top 1.778: JP3.5 JP3.6 | C14.1 137.86,39.2 136.46,39.1 5.OUT
  Bottom 0.406: v135,41 v135,45 | R7.1 117.5,51.5 118.5,52.5 133.5,52.5 v135,51
N$28
  Top 1.778: R7.2 LED7.A
N$29
  Top 1.778: R8.2 LED8.A
N$30
  Top 1.778: R9.2 LED9.K
N$47
  Top 0.61: R12.1 165.5,51 165.5,48.5 167,47 167,45.5 166,44.5 162.5,44.5 158,40 158,24.5 165.5,17 9.OUT
  Top 1.778: JP4.15 JP4.16
  Top 1.93: C20.2 171.91,14.93 JP4.15
  Top 2.184: JP4.15 169.94,15.05 167.5,16 165.8,16 9.OUT
N$48
  Top 1.778: 9.IN 165.56,13.45 162.88,13.45 161.92,12.49 D10.A 163.15,6.31 169.99,6.31 170.78,5.52 C23.2
N$49
  Top 1.778: C22.1 171.92,46.37 169.73,44.18 168.43,42.68 D9.C
  Top 2.184: 7.IN 162.28,22.72 160,25 160,39.5 163,42.5 165.25,42.5 D9.C
N$50  (via drill 0.6)
  Top 0.61: v177,46.5 177,45.5 178,44.5 178,40 177,39.5 C19.2
  Top 1.778: JP4.8 JP4.7 170.66,25.21 168.21,27.67 7.OUT
  Top 1.93: 8.IN 165.74,27.85 7.OUT | C19.2 177.37,37.63 180,35 180,27.5 177.5,25 174.79,25 JP4.8
  Bottom 0.61: v177,46.5 177,49 173.5,52.5 159,52.5 158,51.5 R11.1
N$51  (via drill 0.6)
  Top 0.406: v168,45 168,52 167.5,52.5 151.5,52.5 150.5,51.5 R10.1 | 168,38.85 v168,41
  Top 1.27: C21.1 172.04,36.79 173.8,35.04 176.08,35.04 177.61,33.51 177.61,28.43 176.85,27.67 174.66,27.67 JP4.6 JP4.5
  Top 1.778: C21.1 170.19,38.88 169.23,38.85 168,38.85 166.65,39.24 8.OUT
  Bottom 0.406: v168,41 v168,45
N$52
  Top 1.778: LED10.A 150.27,45.95 R10.2
N$53
  Top 1.778: LED11.A R11.2
N$54
  Top 1.778: LED12.K 165.38,45.95 R12.2
N$55  (via drill 0.6)
  Top 0.61: R18.1 231.5,51 233,52.5 242,52.5 242.5,52 242.5,49.5 246,45.6 246,41.7 v246.1,39.2 | v246.1,24.6 246.2,20.3 246.2,16.7 244.1,15 JP6.16
  Top 1.778: 15.OUT 231.55,16.33 234.07,15.33 236.1,14.9 JP6.15 JP6.16 240.75,14.78 C30.2
  Bottom 0.61: v246.1,24.6 v246.1,39.2
N$56  (via drill 0.6)
  Top 0.61: v192.7,50.1 194,50.5 198,50.5 R15.1 | v192.5,44.9 192.5,42 191.5,41 191.5,24 199,16.5 12.OUT
  Top 1.778: C25.2 204.93,14.85 JP5.15 | JP5.15 JP5.16 | 12.OUT 201.69,16.04 202.5,15.22 202.5,14.97 202.75,14.72 204.8,14.72 JP5.15
  Bottom 0.61: v192.7,50.1 192.5,49 v192.5,44.9
N$57
  Top 1.778: 12.IN 198.51,13.45 196.91,13.45 194.94,11.47 D12.A 201.36,6.47 203.8,4.03 C28.2
N$58
  Top 1.778: C27.1 204.94,46.37 202.5,43.93 201.81,42.43 D11.C 193.41,40.49 193.36,32.94 193.36,24.37 195.08,22.64 10.IN
N$59  (via drill 0.6)
  Top 0.61: v202.5,46.5 202.5,48.5 198.8,52.5 192.5,52.5 191,51 R14.1 | v209.3,43.7 211.5,42 211.5,38 211.16,37.55
  Top 1.778: 10.OUT 200.67,27.72 203.01,25.38 204.81,25.38 JP5.7 JP5.8 211.9,25.13 213.17,26.4 213.17,36.05 211.16,37.55 C24.2
  Top 1.93: 10.OUT 198.71,33.61 11.IN
  Bottom 0.61: v209.3,43.7 207,45.5 203.5,45.5 v202.5,46.5
N$60  (via drill 0.6)
  Top 0.406: v210,46.7 210,45 212.5,42.5 212.5,39 v213.5,38 | 210.07,34.57 v211,35.5 | v210,50.4 207.9,52.5 202,52.5 v201.1,52
  Top 1.27: JP5.5 209.62,27.68 210.63,28.69 210.63,34.02 210.07,34.57 209.87,34.78 206.06,34.78 205.29,35.54 205.29,37.32 C26.1 202.53,39.05 201.23,39.24 198.56,39.24 11.OUT
  Top 1.778: JP5.6 JP5.5
  Bottom 0.406: v210,46.7 v210,50.4 | v211,35.5 v213.5,38 | v201.1,52 200,52.5 185,52.5 183.5,51 R13.1
N$61
  Top 1.778: LED13.A R13.2
N$62
  Top 1.6: LED14.A R14.2
N$63
  Top 1.778: LED15.K 198.15,45.63 R15.2
N$64
  Top 1.778: 15.IN 228.89,13.42 227.9,12.43 227.9,7.45 D14.A 234.38,6.39 234.38,5.39 C33.2
N$65
  Top 1.27: D13.C 227.9,41.97 227.9,38.34 226.38,36.81 226.38,24.62 228.43,22.56 13.IN
  Top 1.778: D13.C 235.81,43.5 C32.1
N$66  (via drill 0.6)
  Top 0.406: 245.43,37.58 245,38 245,45.5 v239.5,51
  Top 1.778: JP6.8 JP6.7 236.6,25.06 235.01,26.65 235.01,27.16 234.76,27.42 231.96,27.42 13.OUT | JP6.8 241.04,25.06 241.11,25.13 | 241.11,25.13 240.69,25.13 JP6.8 | 241.11,25.13 243.9,25.13 246.37,28.59 246.37,35.54 245.43,37.58 242.04,37.58 C29.2
  Top 1.93: 14.IN 231.78,27.7 13.OUT
  Bottom 0.406: v239.5,51 238,52.5 225.5,52.5 224,51 R17.1
N$67  (via drill 0.6)
  Top 0.61: R16.1 217,50.5 219.8,50.5 222.3,52.5 227.9,52.5 v233.9,45.3 | 234,38.85 v234,41
  Top 1.27: JP6.5 243.07,27.6 244.36,29.29 244.36,33.51 243.14,35.04 239.58,35.04 235.82,36.3 235.82,40.49 C31.1
  Top 1.778: JP6.5 JP6.6 | C31.1 237.38,41.73 235.27,38.85 234,38.85 231.81,38.85 14.OUT
  Bottom 0.61: v234,41 v233.9,45.3
N$68
  Top 1.778: LED16.A R16.2
N$69
  Top 1.778: LED17.A R17.2
N$70
  Top 1.778: LED18.K R18.2

### Text on the board
tPlace: + | + | + | + | + | + | -12
bPlace: /Users/Bruno/Desktop/OSLR/PCB_Assets/22_bPlace.bmp
tNames: + | +15V DC IN | - | -15V DC IN
_tNames: F1 | C22 | C27 | C32 | C4 | C8 | C16 | C36 | U$1 | 7805 | C34 | GND | 7812 | C37 | 7912 | C35 | F2 | U$2 | C5 | C9 | C17 | C23 | C28 | C33